# Altium project SeismometerAltium.PrjPcb
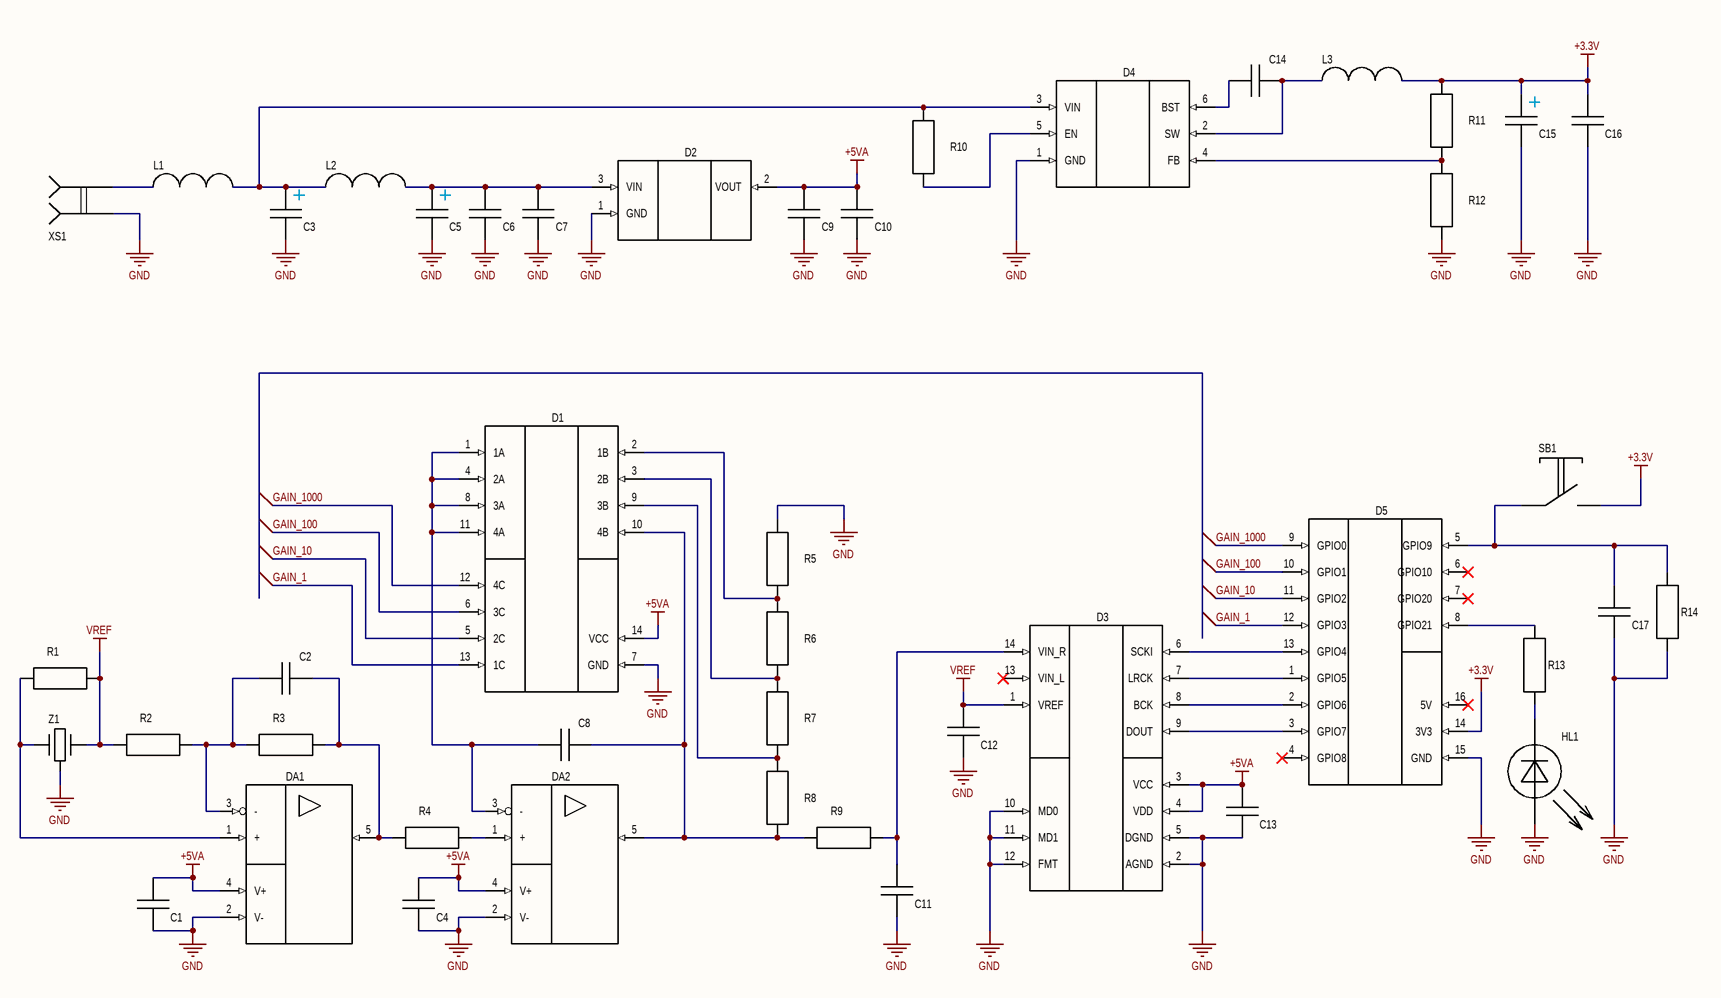
[diagram p0: Sheet1.SchDoc]
1 sheet, 45 parts. Net scope: global (net labels, ports and power ports of the same name join across sheets).
Board file: PCB1.PcbDoc

## Sheet Sheet1.SchDoc: WiFi сенсор вибрации
size 420 x 297 mm; Author: ALTIUM GOSTBOM2.0 KEV; CompanyName: АО "Завод ПРОТОН"; DrawnBy: Синявский; DocumentNumber: 1; Revision: 1; SheetNumber: 1; SheetTotal: 1; SchemeName: WiFi сенсор вибрации; DevelopName: Синявский; CheckName: Саченков; SchemeSheets: 1; SchemeNumber: МИЭТ-110303-24-196-00Э3

### Parts
C1  100  [C_0603_(1608)]  (value not drawn)
C2  100  [C_0603_(1608)]  (value not drawn)
C3  100  [CP_D10_P5_L16]  (value not drawn)
C4  100  [C_0603_(1608)]  (value not drawn)
C5  100  [CP_D10_P5_L16]  (value not drawn)
C6  100  [C_0603_(1608)]  (value not drawn)
C7  100  [C_0603_(1608)]  (value not drawn)
C8  100  [CAPC1608X90N]  (value not drawn)
C9  100  [C_0603_(1608)]  (value not drawn)
C10  100  [C_0603_(1608)]  (value not drawn)
C11  100  [C_0603_(1608)]  (value not drawn)
C12  100  [C_0603_(1608)]  (value not drawn)
C13  100  [C_0603_(1608)]  (value not drawn)
C14  100  [C_0603_(1608)]  (value not drawn)
C15  100  [CP_D10_P5_L16]  (value not drawn)
C16  100  [C_0603_(1608)]  (value not drawn)
C17  100  [C_0603_(1608)]  (value not drawn)
D1  Обозначение при заказе  [TSSOP14]  (value not drawn)
D2  Обозначение при заказе  [SOT223]  (value not drawn)
D3  Обозначение при заказе  [SO-14]  (value not drawn)
D4  Обозначение при заказе  [SOT23-6]  (value not drawn)
D5  Обозначение при заказе  (value not drawn)
DA1  Обозначение при заказе  [TSOT23-5L]  (value not drawn)
DA2  Обозначение при заказе  [TSOT23-5L]  (value not drawn)
HL1  (no value)  [ledrad3mm]
L1  (no value)  [C_0603_(1608)]
L2  (no value)  [C_0603_(1608)]
L3  (no value)  [SS0704]
R1  CR 0402 4,7 кОм ±1%  [R_0603_(1608)]  (value not drawn)
R2  CR 0402 4,7 кОм ±1%  [R_0603_(1608)]  (value not drawn)
R3  CR 0402 4,7 кОм ±1%  [R_0603_(1608)]  (value not drawn)
R4  CR 0402 4,7 кОм ±1%  [R_0603_(1608)]  (value not drawn)
R5  CR 0402 4,7 кОм ±1%  [R_0603_(1608)]  (value not drawn)
R6  CR 0402 4,7 кОм ±1%  [R_0603_(1608)]  (value not drawn)
R7  CR 0402 4,7 кОм ±1%  [R_0603_(1608)]  (value not drawn)
R8  CR 0402 4,7 кОм ±1%  [R_0603_(1608)]  (value not drawn)
R9  CR 0402 4,7 кОм ±1%  [R_0603_(1608)]  (value not drawn)
R10  CR 0402 4,7 кОм ±1%  [R_0603_(1608)]  (value not drawn)
R11  CR 0402 4,7 кОм ±1%  [R_0603_(1608)]  (value not drawn)
R12  CR 0402 4,7 кОм ±1%  [R_0603_(1608)]  (value not drawn)
R13  CR 0402 4,7 кОм ±1%  [R_0603_(1608)]  (value not drawn)
R14  CR 0402 4,7 кОм ±1%  [R_0603_(1608)]  (value not drawn)
SB1  (no value)
XS1  HYR-0142AR  [KLD-0202]  (value not drawn)
Z1  (no value)

### Nets
+3.3V: C15.2 C16.2 D5.14(3V3) L3.2 R11.2 SB1.2
+5VA: C1.2 C4.2 C9.2 C10.2 C13.2 D1.14(VCC) D2.2(VOUT) D3.3(VCC) D3.4(VDD) DA1.4(V+) DA2.4(V+)
GND: C1.1 C3.1 C4.1 C5.1 C6.1 C7.1 C9.1 C10.1 C11.1 C12.1 C13.1 C15.1 C16.1 C17.1 D1.7(GND) D2.1(GND) D3.2(AGND) D3.5(DGND) D3.10(MD0) D3.11(MD1) D3.12(FMT) D4.1(GND) D5.15(GND) DA1.2(V-) DA2.2(V-) HL1.1(A) R5.2 R12.1 R14.1 XS1.1 Z1.E
VREF: C12.2 D3.1(VREF) R1.2 R2.1 Z1.3(OSC2)
GAIN_1: D1.13(1C) D5.12(GPIO3)
GAIN_10: D1.5(2C) D5.11(GPIO2)
GAIN_100: D1.6(3C) D5.10(GPIO1)
GAIN_1000: D1.12(4C) D5.9(GPIO0)
NetC2_1: C2.1 DA1.3(-) R2.2 R3.1
NetC2_2: C2.2 DA1.5 R3.2 R4.1
NetC3_2: C3.2 D4.3(VIN) L1.2 L2.1 R10.2
NetC5_2: C5.2 C6.2 C7.2 D2.3(VIN) L2.2
NetC8_1: C8.1 D1.1(1A) D1.4(2A) D1.8(3A) D1.11(4A) DA2.3(-)
NetC8_2: C8.2 D1.10(4B) DA2.5 R8.1 R9.1
NetC11_2: C11.2 D3.14(VIN_R) R9.2
NetC14_1: C14.1 D4.6(BST)
NetC14_2: C14.2 D4.2(SW) L3.1
NetC17_2: C17.2 D5.5(GPIO9) R14.2 SB1.1
NetD1_2: D1.2(1B) R5.1 R6.2
NetD1_3: D1.3(2B) R6.1 R7.2
NetD1_9: D1.9(3B) R7.1 R8.2
NetD3_6: D3.6(SCKI) D5.13(GPIO4)
NetD3_7: D3.7(LRCK) D5.1(GPIO5)
NetD3_8: D3.8(BCK) D5.2(GPIO6)
NetD3_9: D3.9(DOUT) D5.3(GPIO7)
NetD4_4: D4.4(FB) R11.1 R12.2
NetD4_5: D4.5(EN) R10.1
NetD5_8: D5.8(GPIO21) R13.2
NetDA1_1: DA1.1(+) R1.1 Z1.1(OSC1)
NetDA2_1: DA2.1(+) R4.2
NetHL1_2: HL1.2(C) R13.1
NetL1_1: L1.1 XS1.2

Not connected (* = marked no-connect by the designer): D3 13(VIN_L)*; D5 4(GPIO8)* 6(GPIO10)* 7(GPIO20)* 16(5V)*

### Notes on the sheet
- Перв.примен.
- Справ.№
- Подп. и дата
- Инв.№ дубл.
- Взам.инв.№
- Утвержден
- Подп.и дата
- Разраб.
- Изм.
- Лист
- № докум.
- Подп.
- Дата
- Лит.
- Масса
- Масштаб
- Т.контр.
- Пров.
- Листов
- Инв.№ подл.
- Утв.
- Н.контр.
- Копировал
- Формат  A3

### Library data of the parts
C1-C17 = GRM188R71H104KA93#: Non-polarised capacitor; Manufacturer: MURATA; ManufacturerCountry: США; ValueSCH: 0,1мк; Group: C; Раздел: Прочие изделия; Обозначение: (null); Наименование: Конденсатор; Name: GRM 0603 0,1 мкФ ±10% 50В X7R; PCB_Layout: SMT; ComponentLink1Description: Manufacturer Link; ComponentLink1URL: www.murata.com; ComponentLink2Description: Datasheet Link; ComponentLink2URL: http://www.murata.com/products/catalog/pdf/c02e.pdf; Part Number: GRM188R71H104KA93#; Status: Разрешен; Analog: (null); Pin Count: 2
D1 = SN74HC4066: Описание свойств компонента
D2 = LD1117S50TR: Описание свойств компонента
D3 = PCM1808: Описание свойств компонента
D4 = MT1470: Описание свойств компонента
D5 = ESP32C3: Описание свойств компонента
DA1 DA2 = TLV6741: Описание свойств компонента
HL1 = LED
L1-L3 = Inductor
R1-R14 = CR0402-FX-4701G: Manufacturer: Bourns; ManufacturerCountry: США; Group: R; Раздел: Прочие изделия; Обозначение: (null); Наименование: Резистор; PCB_Layout: SMT; ComponentLink1Description: Manufacturer Link; ComponentLink1URL: www.bourns.com; ComponentLink2Description: Datasheet Link; ComponentLink2URL: http://www.bourns.com/data/global/pdfs/CR0402.pdf; Part Number: CR0402-FX-4701G; Status: Разрешен; Analog: (null); Name: CR 0402 4,7 кОм ±1%; Pin Count: 2
SB1 = SW-PB
XS1 = XS2: HYR-0142AR (GB-142AR) (BNC-7044), Разъем BNC, гнездо угловое, на плату
Z1 = XTALE